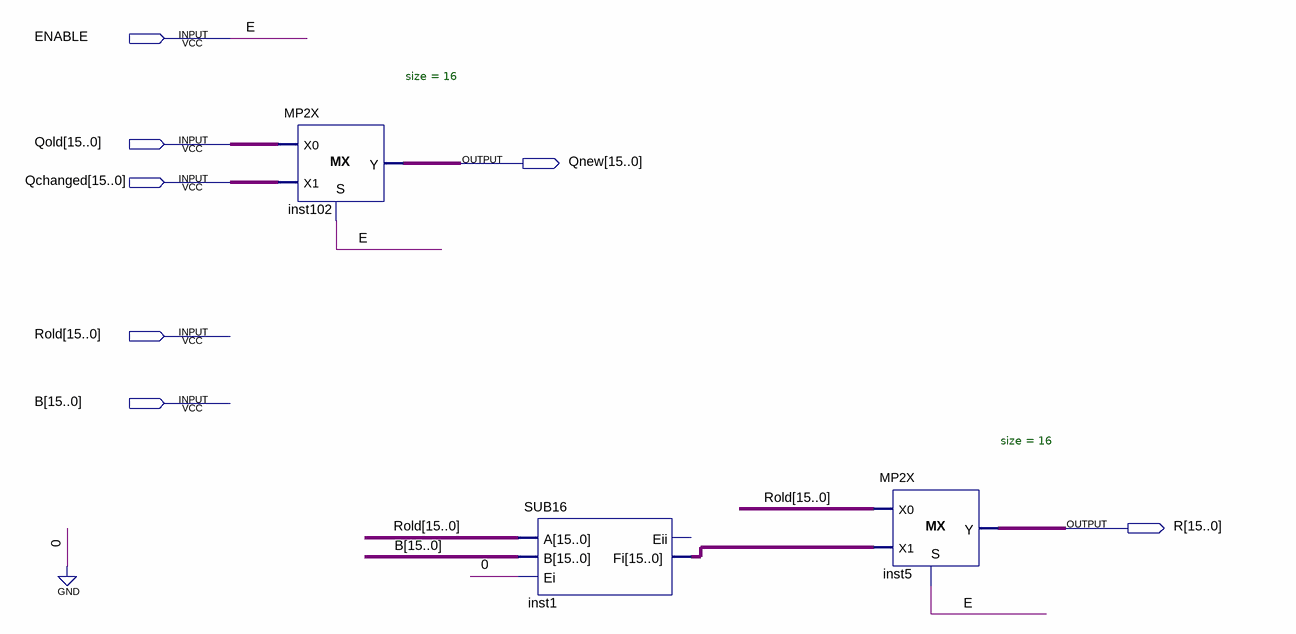
[diagram p0: schematic sheet]
// Quartus schematic CHANGER16.bdf as structural Verilog: 3 symbols, 7 pins
module CHANGER16 (
  input  ENABLE,
  input  [15:0] Qold,
  input  [15:0] Qchanged,
  input  [15:0] Rold,
  input  [15:0] B,
  output [15:0] Qnew,
  output [15:0] R
);

  wire [15:0] inst1_fi;

  MP2X #(.size(16)) inst102 (.S(ENABLE), .X0(Qold), .X1(Qchanged), .Y(Qnew));
  SUB16 inst1 (.A(Rold), .B(B), .Ei(1'b0), .Fi(inst1_fi));  // open: Eii
  MP2X #(.size(16)) inst5 (.S(ENABLE), .X0(Rold), .X1(inst1_fi), .Y(R));

  // Other names for the same wires on the sheet: E = ENABLE
endmodule
